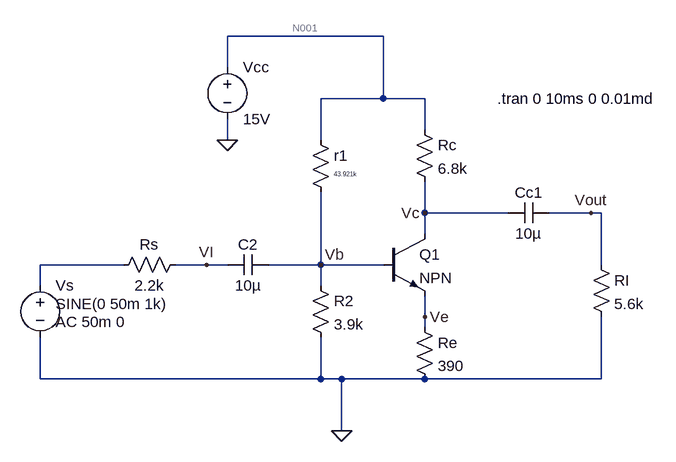
[diagram p0: schematic 4b.asc]
4b.asc, the LTspice schematic file:
Version 4
SHEET 1 880 680
WIRE 176 -192 -64 -192
WIRE -64 -144 -64 -192
WIRE 176 -96 176 -192
WIRE 176 -96 80 -96
WIRE 240 -96 176 -96
WIRE 240 -48 240 -96
WIRE -64 -32 -64 -64
WIRE 80 -32 80 -96
WIRE 240 80 240 32
WIRE 368 80 240 80
WIRE 496 80 432 80
WIRE 512 80 496 80
WIRE 240 112 240 80
WIRE -224 160 -352 160
WIRE -96 160 -144 160
WIRE -64 160 -96 160
WIRE 80 160 80 48
WIRE 80 160 0 160
WIRE 176 160 80 160
WIRE 512 160 512 80
WIRE -352 192 -352 160
WIRE 80 192 80 160
WIRE 240 240 240 208
WIRE 240 256 240 240
WIRE -352 336 -352 272
WIRE 80 336 80 272
WIRE 80 336 -352 336
WIRE 112 336 80 336
WIRE 240 336 112 336
WIRE 512 336 512 240
WIRE 512 336 240 336
WIRE 112 416 112 336
FLAG -64 -32 0
FLAG 112 416 0
FLAG -96 160 VI
FLAG 240 240 Ve
FLAG 240 80 Vc
FLAG 80 160 Vb
FLAG 496 80 Vout
SYMBOL npn 176 112 R0
SYMATTR InstName Q1
SYMBOL cap 368 96 R270
WINDOW 0 32 32 VTop 2
WINDOW 3 0 32 VBottom 2
SYMATTR InstName Cc1
SYMATTR Value 10µ
SYMBOL res 496 144 R0
SYMATTR InstName RI
SYMATTR Value 5.6k
SYMBOL res 224 -64 R0
SYMATTR InstName Rc
SYMATTR Value 6.8k
SYMBOL cap 0 144 R90
WINDOW 0 0 32 VBottom 2
WINDOW 3 32 32 VTop 2
SYMATTR InstName C2
SYMATTR Value 10µ
SYMBOL res -128 144 R90
WINDOW 0 0 56 VBottom 2
WINDOW 3 32 56 VTop 2
SYMATTR InstName Rs
SYMATTR Value 2.2k
SYMBOL voltage -64 -160 R0
SYMATTR InstName Vcc
SYMATTR Value 15V
SYMBOL res 64 -48 R0
WINDOW 3 36 68 Left 0
SYMATTR Value 43.921k
SYMATTR InstName r1
SYMBOL res 224 240 R0
SYMATTR InstName Re
SYMATTR Value 390
SYMBOL res 64 176 R0
SYMATTR InstName R2
SYMATTR Value 3.9k
SYMBOL voltage -352 176 R0
WINDOW 3 24 44 Left 2
WINDOW 123 24 72 Left 2
WINDOW 39 0 0 Left 0
SYMATTR Value SINE(0 50m 1k)
SYMATTR Value2 AC 50m 0
SYMATTR InstName Vs
TEXT 352 -96 Left 2 !.tran 0 10ms 0 0.01md

The netlist it stands for:
* 4b.asc
Q1 Vc Vb Ve 0 NPN
Cc1 Vc Vout 10µ
RI Vout 0 5.6k
Rc N001 Vc 6.8k
C2 Vb VI 10µ
Rs VI N002 2.2k
Vcc N001 0 15V
r1 N001 Vb 43.921k
Re Ve 0 390
R2 Vb 0 3.9k
Vs N002 0 SINE(0 50m 1k) AC 50m 0
.model NPN NPN
.model PNP PNP
.lib standard.bjt
.tran 0 10ms 0 0.01md
.backanno
.end

* Results of the author's LTspice run, read from the files saved beside the schematic
* Operating Point, zero values left out:
*   V(vc) = 7.911 V
*   V(vb) = 1.186 V
*   V(ve) = 410.7 mV
*   V(n001) = 15 V
*   Ic(Q1) = 1.043 mA
*   Ib(Q1) = 10.43 µA
*   Ie(Q1) = -1.053 mA
*   I(R2) = 304.1 µA
*   I(Re) = 1.053 mA
*   I(R1) = 314.5 µA
*   I(Rc) = 1.043 mA
*   I(Vcc) = -1.357 mA
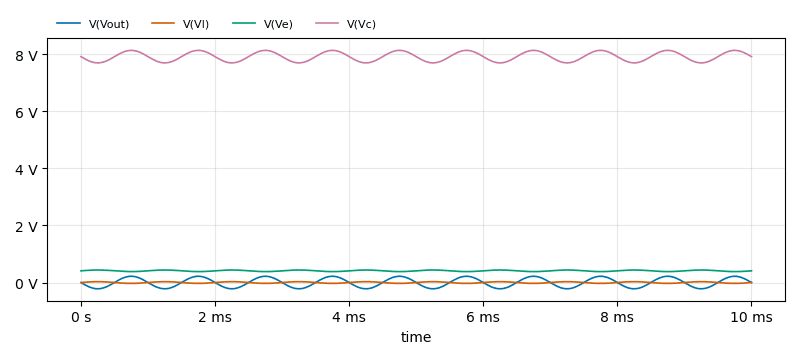
[diagram p1: Transient Analysis of 4b.asc, plotted from the saved traces]
* Transient Analysis, 1 run:
*   V(Vout): min -219.4 mV, max 220.2 mV, average 621.5 µV, rms 155.4 mV, last -154.5 µV
*   V(VI): min -29.92 mV, max 30.02 mV, average 52.02 µV, rms 21.19 mV, last -9.461 µV
*   V(Ve): min 382.5 mV, max 438.8 mV, average 410.6 mV, rms 411.1 mV, last 410.7 mV
*   V(Vc): min 7.691 V, max 8.13 V, average 7.911 V, rms 7.912 V, last 7.911 V